# EAGLE design as3320-BandPass-Dev1 (EAGLE 9.6.2)

## Sheet 1 of 5: CEM
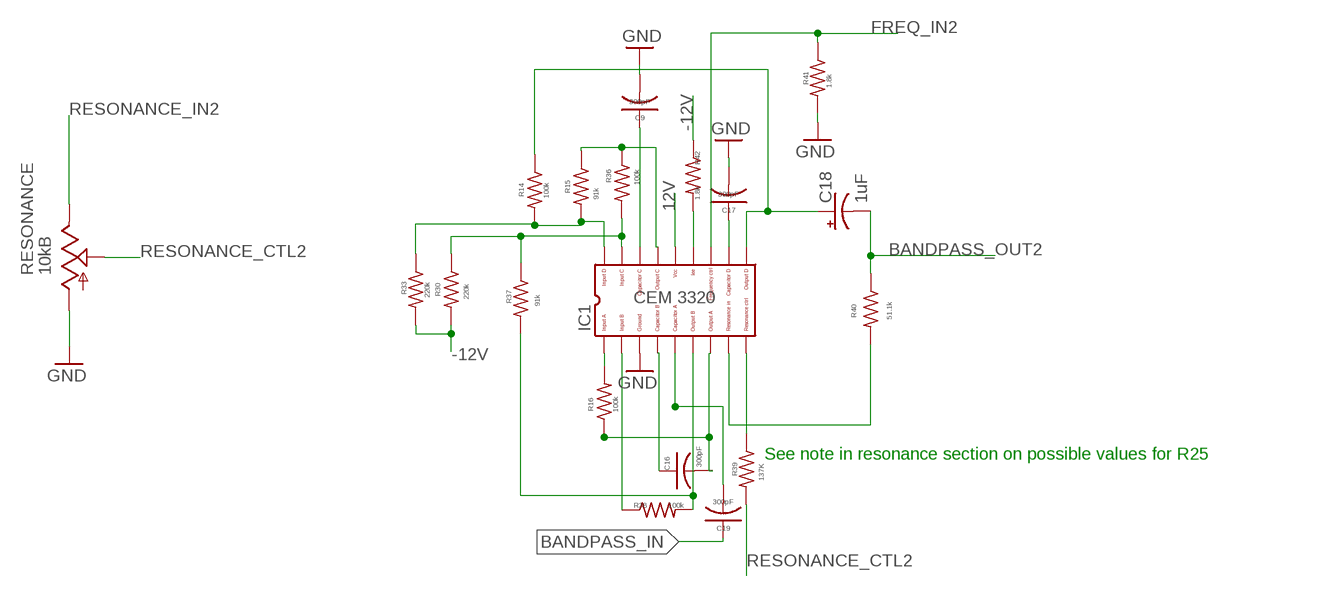
[diagram p0: schematic, sheet 1]

### Parts
C9  300pF  C-USC0805K  [C0805K]
C16  300pF  C-USC0805K  [C0805K]
C17  300pF  C-USC0805K  [C0805K]
C18  1uF  CPOL-USB  [PANASONIC_B]
C19  300pF  C-USC0805K  [C0805K]
IC1  CEM3320  [DIL18]
R14  100k  GMSN_R-US_M0805  [GMSN_M0805]
R15  91k  GMSN_R-US_M0805  [GMSN_M0805]
R16  100k  GMSN_R-US_M0805  [GMSN_M0805]
R30  220k  GMSN_R-US_M0805  [GMSN_M0805]
R33  220k  GMSN_R-US_M0805  [GMSN_M0805]
R36  100k  GMSN_R-US_M0805  [GMSN_M0805]
R37  91k  GMSN_R-US_M0805  [GMSN_M0805]
R38  100k  GMSN_R-US_M0805  [GMSN_M0805]
R39  137K  GMSN_R-US_M0805  [GMSN_M0805]
R40  51.1k  GMSN_R-US_M0805  [GMSN_M0805]
R41  1.8k  GMSN_R-US_M0805  [GMSN_M0805]
R42  1.8k  GMSN_R-US_M0805  [GMSN_M0805]
RESONANCE  10kB  POT_USVERTICAL  [ALPS_POT_VERTICAL]

### Nets
12V [power]: IC1.14 ; also sheet 2,3
-12V [power]: R30.2 R33.2 R42.1 ; also sheet 2,3
BANDPASS_IN: C19.1 ; also sheet 3
BANDPASS_OUT2: C18.- R40.1 ; also sheet 5
FREQ_IN2: IC1.12 R41.1 ; also sheet 3
GND [power]: C9.2 C17.2 IC1.3 R41.2 RESONANCE.P$3(A) ; also sheet 2,3,4,5
N$18 [nearfilter]: C17.1 IC1.11
N$21: IC1.9 R39.1
N$28 [nearfilter]: IC1.8 R40.2
N$29 [nearfilter]: IC1.13 R42.2
N$30: C9.1 IC1.16
N$31 [nearfilter]: C18.+ IC1.10 R14.1
N$32: C19.2 IC1.5
N$33: C16.2 IC1.7 R16.1
N$34: C16.1 IC1.4
N$35: IC1.2 R38.1
N$36: IC1.6 R37.2 R38.2
N$37: IC1.1 R16.2
N$38: IC1.17 R30.1 R36.2 R37.1
N$41: IC1.15 R15.1 R36.1
N$42: IC1.18 R14.2 R15.2 R33.1
RESONANCE_CTL2: R39.2 RESONANCE.P$2(S)
RESONANCE_IN2: RESONANCE.P$1(E) ; also sheet 3

### Notes on the sheet
- See note in resonance section on possible values for R25

## Sheet 2 of 5: Power
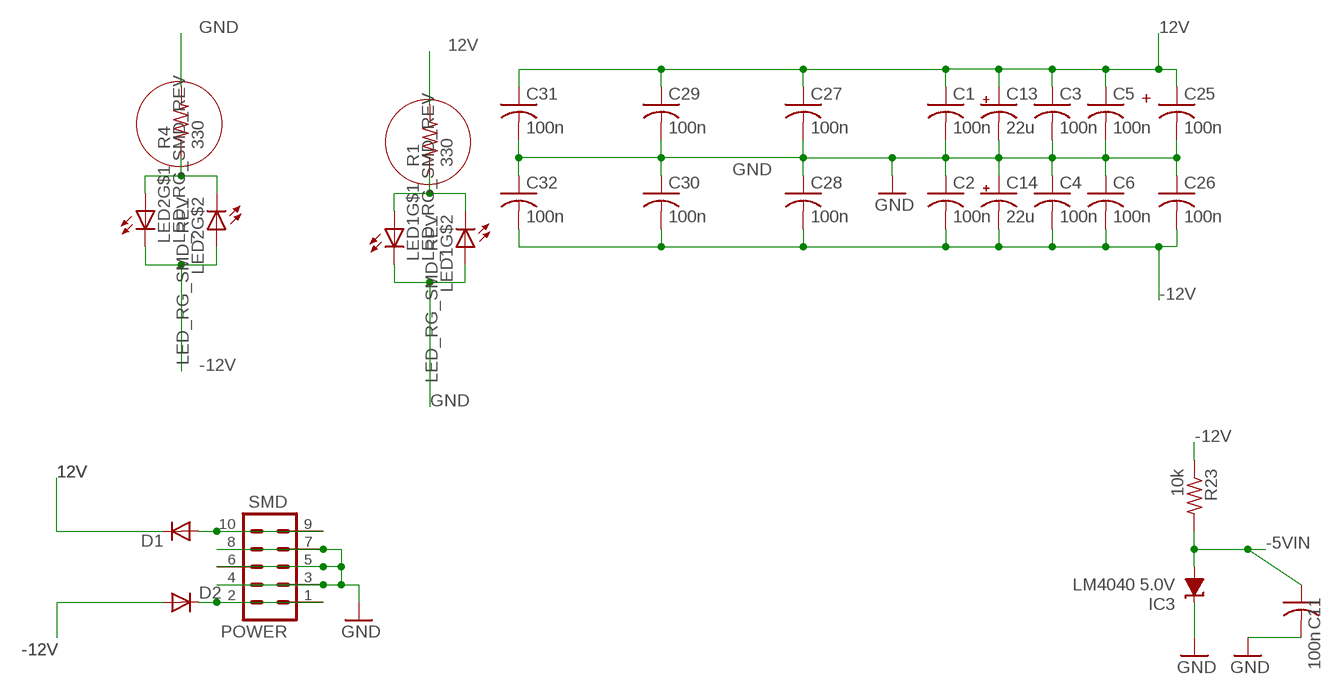
[diagram p1: schematic, sheet 2]

### Parts
C1  100n  C-USC0805K  [C0805K]
C2  100n  C-USC0805K  [C0805K]
C3  100n  C-USC0805K  [C0805K]
C4  100n  C-USC0805K  [C0805K]
C5  100n  C-USC0805K  [C0805K]
C6  100n  C-USC0805K  [C0805K]
C11  100n  GMSN_C-USC0805K  [GMSN_C0805K]
C13  22u  CPOL-USB  [PANASONIC_B]
C14  22u  CPOL-USB  [PANASONIC_B]
C25  100n  C-USC0805K  [C0805K]
C26  100n  C-USC0805K  [C0805K]
C27  100n  C-USC0805K  [C0805K]
C28  100n  C-USC0805K  [C0805K]
C29  100n  C-USC0805K  [C0805K]
C30  100n  C-USC0805K  [C0805K]
C31  100n  C-USC0805K  [C0805K]
C32  100n  C-USC0805K  [C0805K]
D1  1N5819HW  DIODE-SOD123  [SOD123]
D2  1N5819HW  DIODE-SOD123  [SOD123]
IC3  LM4040 5.0V  LM4041C12DBZ  [DBZ_R-PDSO-G3]
LED1  LED_RG_SMD_REV  [LSG_T77K]
LED2  LED_RG_SMD_REV  [LSG_T77K]
POWER  SMD  CONN_05X2SHD_SMD  [2X5-SHROUDED_SMD]
R1  330  GMSN_R-US_M0805  [GMSN_M0805]
R4  330  GMSN_R-US_M0805  [GMSN_M0805]
R23  10k  GMSN_R-US_M0805  [GMSN_M0805]

### Nets
12V [power]: C1.1 C3.1 C5.1 C13.+ C25.1 C27.1 C29.1 C31.1 D1.C R1.2 ; also sheet 1,3
-5VIN [power]: C11.1 IC3.2(A) R23.2 ; also sheet 4
-12V [power]: C2.2 C4.2 C6.2 C14.- C26.2 C28.2 C30.2 C32.2 D2.A LED2.1(C) LED2.4(A) R23.1 ; also sheet 1,3
-12V-P: D2.C POWER.1 POWER.2
GND [power]: C1.2 C2.1 C3.2 C4.1 C5.2 C6.1 C11.2 C13.- C14.+ C25.2 C26.1 C27.2 C28.1 C29.2 C30.1 C31.2 C32.1 IC3.1(C) LED1.1(C) LED1.4(A) POWER.3 POWER.4 POWER.5 POWER.6 POWER.7 POWER.8 R4.2 ; also sheet 1,3,4,5
N$6: D1.A POWER.9 POWER.10
N$74: LED2.2(A) LED2.3(C) R4.1
N$75: LED1.2(A) LED1.3(C) R1.1

### Notes on the sheet
- +

## Sheet 3 of 5: Input
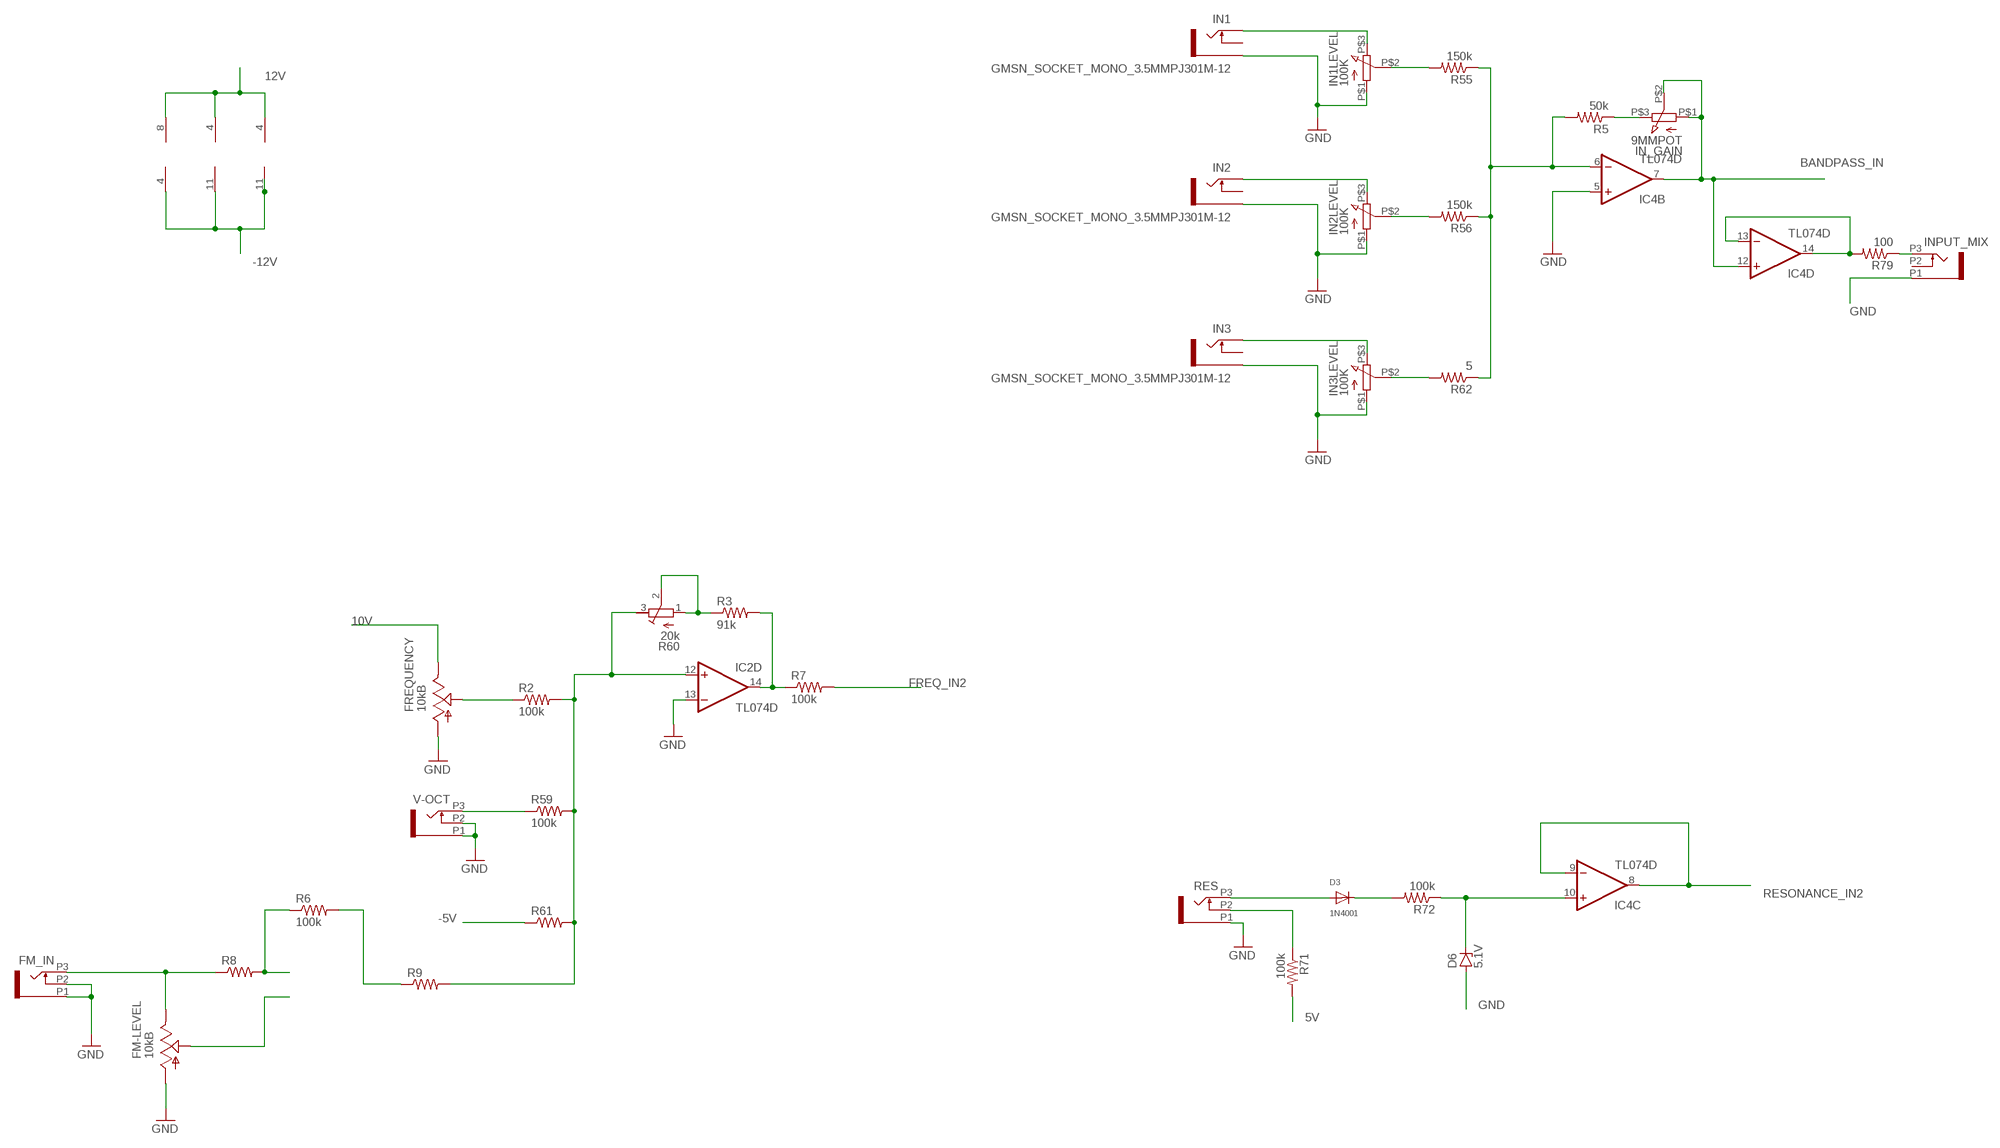
[diagram p2: schematic, sheet 3]

### Parts
D3  1N4001  DIODESMA  [SMADIODE]
D6  5.1V  ZENER-DIODESOT23  [SOT23]
FM-LEVEL  10kB  POT_USVERTICAL  [ALPS_POT_VERTICAL]
FM_IN  PJ301_THONKICONN6  [WQP_PJ_301M6]
FREQUENCY  10kB  POT_USVERTICAL  [ALPS_POT_VERTICAL]
IC2  TL074D  [SO14]
IC4  TL074D  [SO14]
IC5  TL072D  [SO08]
IN1  GMSN_SOCKET_MONO_3.5MMPJ301M-12  [GMSN_PJ301M-12]
IN1LEVEL  100K  9MMPOT  [POT]
IN2  GMSN_SOCKET_MONO_3.5MMPJ301M-12  [GMSN_PJ301M-12]
IN2LEVEL  100K  9MMPOT  [POT]
IN3  GMSN_SOCKET_MONO_3.5MMPJ301M-12  [GMSN_PJ301M-12]
IN3LEVEL  100K  9MMPOT  [POT]
IN_GAIN  9MMPOT  [POT]
INPUT_MIX  PJ301_THONKICONN6  [WQP_PJ_301M6]
R2  100k  GMSN_R-US_M0805  [GMSN_M0805]
R3  91k  GMSN_R-US_M0805  [GMSN_M0805]
R5  50k  GMSN_R-US_M0805  [GMSN_M0805]
R6  100k  GMSN_R-US_M0805  [GMSN_M0805]
R7  100k  GMSN_R-US_M0805  [GMSN_M0805]
R8  62k  GMSN_R-US_M0805  [GMSN_M0805]
R9  62k  GMSN_R-US_M0805  [GMSN_M0805]
R55  150k  R-US_R0805  [R0805]
R56  150k  R-US_R0805  [R0805]
R59  100k  GMSN_R-US_M0805  [GMSN_M0805]
R60  20k  R-TRIMM3296X  [RTRIM3296X]
R61  62k  GMSN_R-US_M0805  [GMSN_M0805]
R62  5  R-US_R0805  [R0805]
R71  100k  R-US_R0805  [R0805]
R72  100k  GMSN_R-US_M0805  [GMSN_M0805]
R79  100  GMSN_R-US_M0805  [GMSN_M0805]
RES  PJ301_THONKICONN6  [WQP_PJ_301M6]
V-OCT  PJ301_THONKICONN6  [WQP_PJ_301M6]

### Nets
5V [power]: R71.2 ; also sheet 4
10V [power]: FREQUENCY.P$1(E) ; also sheet 4
12V [power]: IC2.4(P:V+) IC4.4(P:V+) IC5.8(P:V+) ; also sheet 1,2
-5V [power]: R61.1 ; also sheet 4
-12V [power]: IC2.11(P:V-) IC4.11(P:V-) IC5.4(P:V-) ; also sheet 1,2
BANDPASS_IN: IC4.7(B:OUT) IC4.12(D:+IN) IN_GAIN.P$1 IN_GAIN.P$2 ; also sheet 1
FREQ_IN2: R7.2 ; also sheet 1
GND [power]: D6.1(A) FM-LEVEL.P$3(A) FM_IN.P1 FM_IN.P2 FREQUENCY.P$3(A) IC2.13(D:-IN) IC4.5(B:+IN) IN1.GND(SLEEVE) IN1LEVEL.P$1 IN2.GND(SLEEVE) IN2LEVEL.P$1 IN3.GND(SLEEVE) IN3LEVEL.P$1 INPUT_MIX.P1 RES.P1 V-OCT.P1 V-OCT.P2 ; also sheet 1,2,4,5
N$1: R6.2 R9.1
N$2: R6.1 R8.2
N$3: IC2.14(D:OUT) R3.2 R7.1
N$5: FREQUENCY.P$2(S) R2.1
N$7: FM-LEVEL.P$2(S)
N$8: FM-LEVEL.P$1(E) FM_IN.P3 R8.1
N$9: R71.1 RES.P2
N$12: IC2.12(D:+IN) R2.2 R9.2 R59.2 R60.3(A) R61.2
N$20: IN_GAIN.P$3 R5.1
N$67: R59.1 V-OCT.P3
N$68: R3.1 R60.1(E) R60.2(S)
N$76: IN1.TIP IN1LEVEL.P$3
N$77: IN2.TIP IN2LEVEL.P$3
N$78: D3.A RES.P3
N$79: IN1LEVEL.P$2 R55.2
N$80: IN2LEVEL.P$2 R56.2
N$82: IN3.TIP IN3LEVEL.P$3
N$83: IN3LEVEL.P$2 R62.2
N$84: IC4.6(B:-IN) R5.2 R55.1 R56.1 R62.1
N$85: D3.C R72.2
N$89: D6.3(C) IC4.10(C:+IN) R72.1
N$102: IC4.13(D:-IN) IC4.14(D:OUT) R79.2
N$103: INPUT_MIX.P3 R79.1
RESONANCE_IN2: IC4.8(C:OUT) IC4.9(C:-IN) ; also sheet 1
Unconnected: IC5.1(A:OUT) IC5.2(A:-IN) IC5.3(A:+IN) IN1.NORM(SWITCH) IN2.NORM(SWITCH) IN3.NORM(SWITCH) INPUT_MIX.P2

## Sheet 4 of 5: Ref
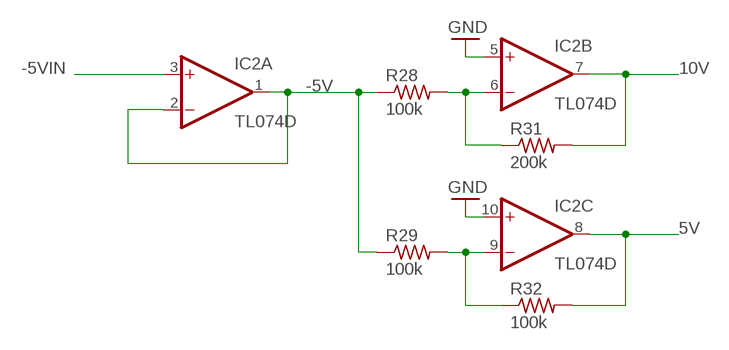
[diagram p3: schematic, sheet 4]

### Parts
R28  100k  GMSN_R-US_M0805  [GMSN_M0805]
R29  100k  GMSN_R-US_M0805  [GMSN_M0805]
R31  200k  GMSN_R-US_M0805  [GMSN_M0805]
R32  100k  GMSN_R-US_M0805  [GMSN_M0805]

### Nets
5V [power]: IC2.8(C:OUT) R32.2 ; also sheet 3
10V [power]: IC2.7(B:OUT) R31.2 ; also sheet 3
-5V [power]: IC2.1(A:OUT) IC2.2(A:-IN) R28.1 R29.1 ; also sheet 3
-5VIN [power]: IC2.3(A:+IN) ; also sheet 2
GND [power]: IC2.5(B:+IN) IC2.10(C:+IN) ; also sheet 1,2,3,5
N$13: IC2.9(C:-IN) R29.2 R32.1
N$15: IC2.6(B:-IN) R28.2 R31.1

## Sheet 5 of 5: Output
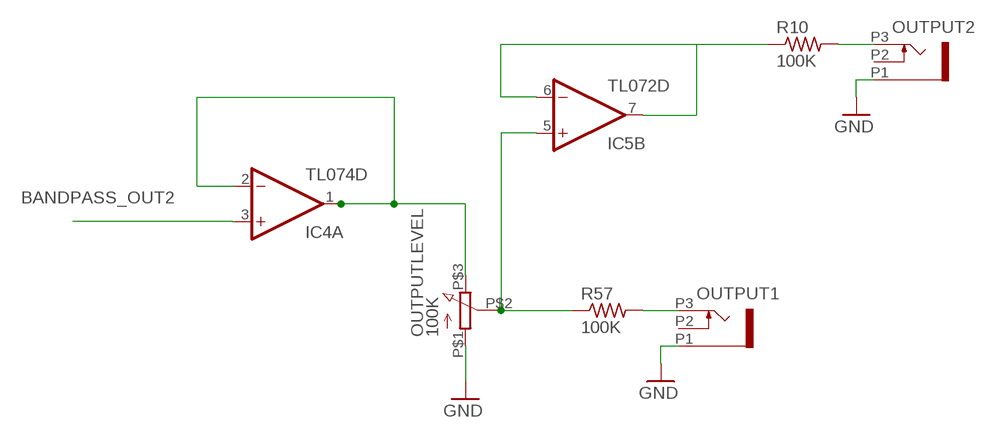
[diagram p4: schematic, sheet 5]

### Parts
OUTPUT1  PJ301_THONKICONN6  [WQP_PJ_301M6]
OUTPUT2  PJ301_THONKICONN6  [WQP_PJ_301M6]
OUTPUTLEVEL  100K  9MMPOT  [POT]
R10  100K  GMSN_R-US_M0805  [GMSN_M0805]
R57  100K  GMSN_R-US_M0805  [GMSN_M0805]

### Nets
BANDPASS_OUT2: IC4.3(A:+IN) ; also sheet 1
GND [power]: OUTPUT1.P1 OUTPUT2.P1 OUTPUTLEVEL.P$1 ; also sheet 1,2,3,4
N$10: IC5.6(B:-IN) IC5.7(B:OUT)
N$11: IC5.5(B:+IN) OUTPUTLEVEL.P$2 R57.1
N$14: R10.1
N$63: IC4.1(A:OUT) IC4.2(A:-IN) OUTPUTLEVEL.P$3
O1: OUTPUT2.P3 R10.2
O2: OUTPUT1.P3 R57.2
Unconnected: OUTPUT1.P2 OUTPUT2.P2

## Library data of the parts
C1-C6 C9 C16 C17 C19 C25-C32 = rcl:C-US: CAPACITOR, American symbol; SPICEPREFIX: C
C11 = Pure VCF:GMSN_C-US: CAPACITOR, American symbol
C13 C14 = rcl:CPOL-US: POLARIZED CAPACITOR, American symbol
C18 = rcl:CPOL-US: POLARIZED CAPACITOR, American symbol; SPICEPREFIX: C
D1 D2 = diode:DIODE-: DIODE
D3 = GMSN:DIODE: Diode SMADIODE - SMA Surface Mount Package 20V 1A Schottky Diode Digikey: 641-1014-6-ND DO-1N4148 - Through Hole Small Current Diode SOD-123 20V 1 A (.5mV Vf) Schottky Diode - Digikey: MBRX120TPMSCT-ND SOD-323 10V 570mA (.38mV Vf, 3ns) Schottky Diode - Digikey: ZLLS410CT-ND SOD-523 30V 30mA Schottky Diode (RB751S-40TE61) - Digikey: RB751S-40TE61CT-ND SOT23-R/W - SOT23 Package (R = Solder Paste/Reflow Ovens, W = Hand-Soldering) BAT54Film 40V 300mA - Digikey: 497-7162-1-ND
D6 = diode:ZENER-DIODE: Z-Diode; RS-PART: 816-7962
FM-LEVEL FREQUENCY RESONANCE = og-pots:POT_US
FM_IN INPUT_MIX OUTPUT1 OUTPUT2 RES V-OCT = og-pj301_variations:PJ301_THONKICONN
IC1 = CEM:CEM3320: CEM 3330 VCF
IC2 = linear:TL074: OP AMP
IC3 = texas:LM4041: PRECISION MICROPOWER SHUNT VOLTAGE REFERENCE Source: http://focus.ti.com/lit/ds/slcs146e/slcs146e.pdf
IC4 = GMSN:TL074: OP AMP
IC5 = GMSN-R2Project:TL072: OP AMP
IN1-IN3 = Pure VCO:GMSN_SOCKET_MONO_3.5MM: 3.5 mm Jack Socket; SORT: 8
IN1LEVEL IN2LEVEL IN3LEVEL IN_GAIN OUTPUTLEVEL = GMSN:9MMPOT
LED1 = INSTRUO:LED_RG_SMD_REV: http://uk.rs-online.com/web/p/visible-leds/7193196/; RS-PART: 915-4828
LED2 = INSTRUO:LED_RG_SMD_REV: http://uk.rs-online.com/web/p/visible-leds/7193196/
POWER = SparkFun-Connectors:CONN_05X2: Multi connection point. Often used as Generic Header-pin footprint for 0.1 inch spaced/style header connections For AVR SPI programming port, see special device with nice symbol: "AVR_SPI_PROG_5x2.dev" You can populate with any combo of single row headers, but if you'd like an exact match, check these: 2x5 AVR ICSP Male Header <https://www.sparkfun.com/products/778> (PRT-00778) 2x5 Pin Shrouded Header <https://www.sparkfun.com/products/8506> (PRT-08506) On any of the 0.1 inch spaced packages, you can populate with these: Break Away Headers - Straight <https://www.sparkfun.com/products/116> (PRT-00116) Break Away Male Headers - Right Angle <https://www.sparkfun.com/products/553> (PRT-00553) Female Headers <https://www.sparkfun.com/products/115> (PRT-00115) Break Away Headers - Machine Pin <https://www.sparkfun.com/products/117> (PRT-00117) Break Away Female Headers - Swiss Machine Pin <https://www.sparkfun.com/products/743> (PRT-00743) Special note: the shrouded connector mates well with our 5x2 ribbon cables: 2x5 Pin IDC Ribbon Cable <https://www.sparkfun.com/products/8535> (PRT-08535); PROD_ID: CONN-09508; RS-PART: 828-1783
R1-R3 R5-R10 R14-R16 R23 R28-R33 R36-R42 R57 R59 R61 R72 R79 = Pure VCF:GMSN_R-US_: RESISTOR, American symbol
R4 = Pure VCF:GMSN_R-US_: RESISTOR, American symbol; RS-PART: 915-4828
R55 R56 R62 R71 = GMSN:R-US_: RESISTOR, American symbol
R60 = rcl:R-TRIMM: Trimm resistor

## Net classes
0 default: width 0.152 mm
1 power: width 0.406 mm
2 nearfilter: width 0.152 mm

## Board
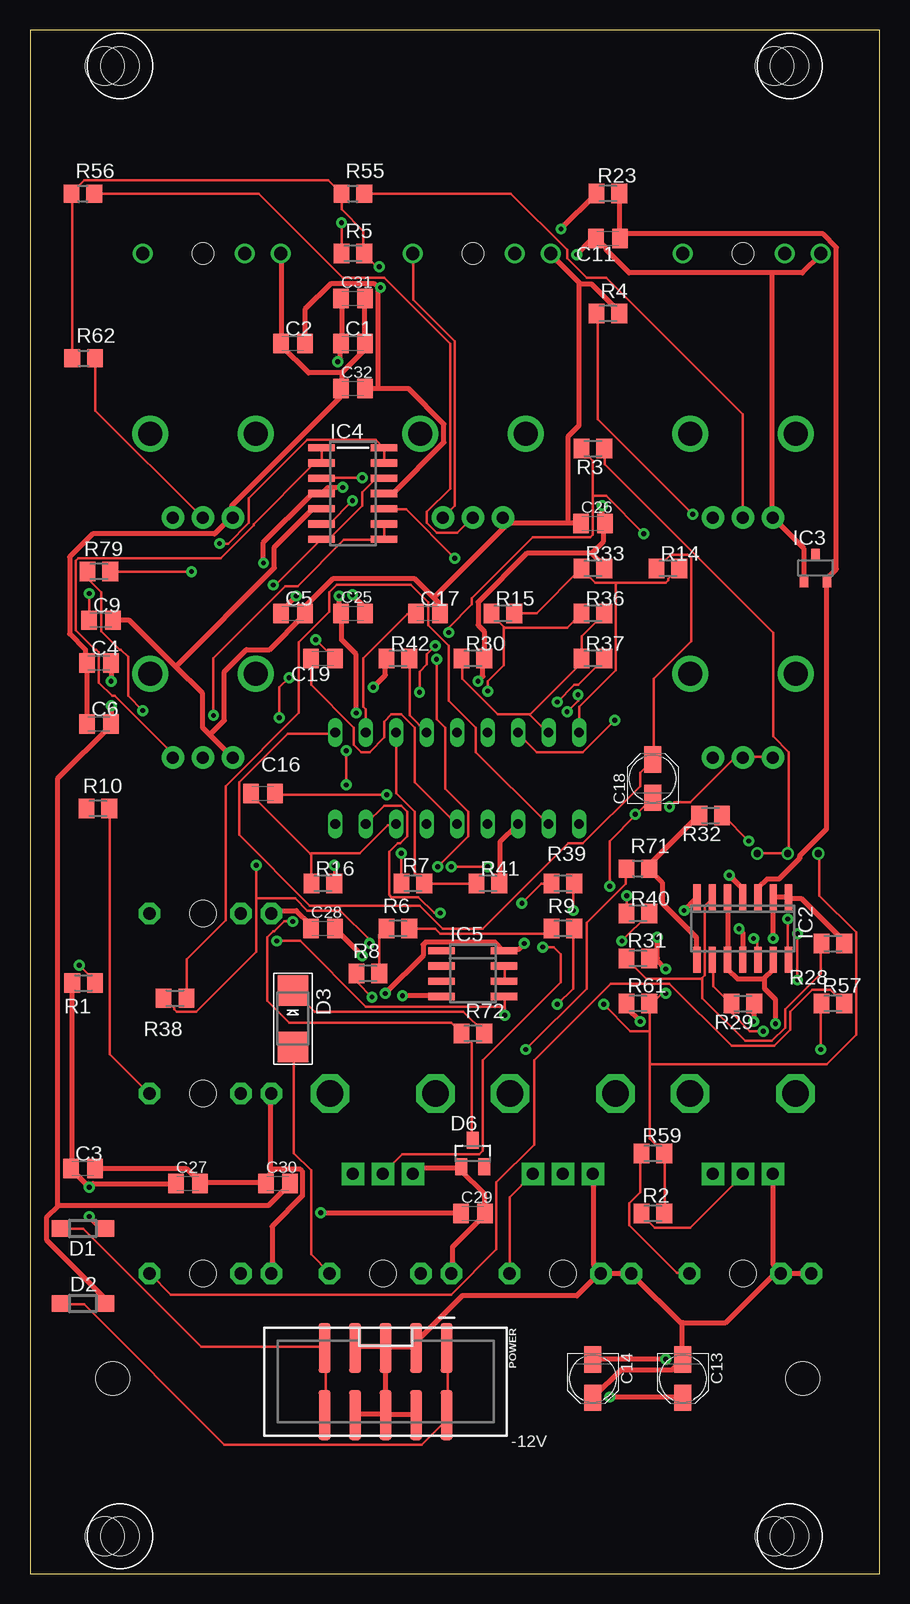
[diagram p5: board, top side]
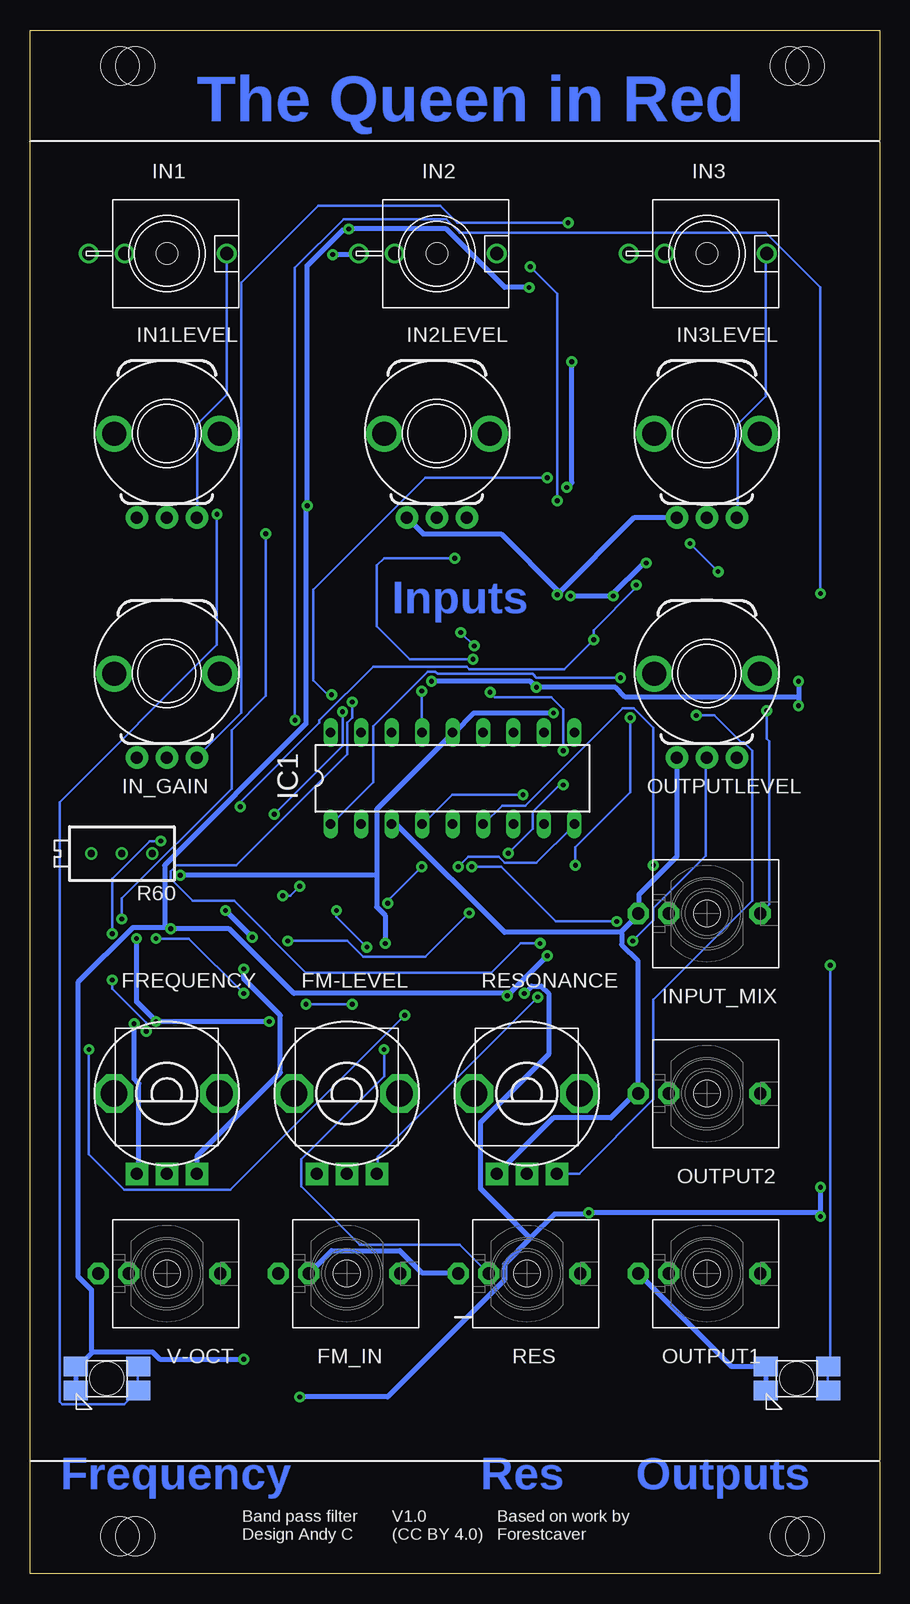
[diagram p6: board, bottom side, seen from below]

Size 70.8 x 128.63 mm. Coordinates in mm from the lower left corner, seen from the top.
Outline: 70.8,0 70.8,128.63 0,128.63 0,0 70.8,0
Copper layers (1*16): Top 0.035mm / dielectric 1.5mm / Bottom 0.035mm
Design rules "Mutable_PCBCart-Standard *": minimum track width 8mil, minimum drill 0.4mm, track to track 8mil, track to pad 8mil, pad to pad 8mil, via to via 8mil, smd to smd 8mil, copper to edge 20mil, drill to drill 8mil, minimum pad ring 8mil, minimum via ring 10mil, stop-mask expansion 3mil, vias tented up to drill 25mil, thermal gap 8mil

### Footprints (pad centres in the part's own frame; a part is rotated, then mirrored left to right if it is on the bottom)
C0805K = smd 1.3 x 1.6: 1 -1,0; 2 1,0
GMSN_C0805K = smd 1.3 x 1.6: 1 -1,0; 2 1,0
PANASONIC_B = smd 2.2 x 1.4: + 1.6,0; - -1.6,0
SOD123 = smd 1.4 x 1.4: A 1.9,0; C -1.9,0
SMADIODE = smd 2.54 x 2.54: A 2.349,0; C -2.349,0
SOT23 = smd 1 x 1.4: 1 -0.95,-1.1; 2 0.95,-1.1; 3 0,1.1
ALPS_POT_VERTICAL = drill 1 pad 1.88 square: P$1 -2.5,6.7; P$2 0,6.7; P$3 2.5,6.7 | drill 2.2 pad 3.175 octagon: P$4 -4.4,0; P$5 4.4,0
WQP_PJ_301M6 = drill 1.016 pad 1.778 octagon: P1 0,-5.715; P2 0,-3.175; P3 0,4.445 | hole 2.2: 0,0
DIL18 = drill 0.813 long: 1 -10.16,-3.81; 2 -7.62,-3.81; 3 -5.08,-3.81; 4 -2.54,-3.81; 5 0,-3.81; 6 2.54,-3.81; 7 5.08,-3.81; 8 7.62,-3.81; 9 10.16,-3.81; 10 10.16,3.81; 11 7.62,3.81; 12 5.08,3.81; 13 2.54,3.81; 14 0,3.81; 15 -2.54,3.81; 16 -5.08,3.81; 17 -7.62,3.81; 18 -10.16,3.81
SO14 = smd 0.6 x 2.2: 1 -3.81,-2.6; 2 -2.54,-2.6; 3 -1.27,-2.6; 4 0,-2.6; 5 1.27,-2.6; 6 2.54,-2.6; 7 3.81,-2.6; 8 3.81,2.6; 9 2.54,2.6; 10 1.27,2.6; 11 0,2.6; 12 -1.27,2.6; 13 -2.54,2.6; 14 -3.81,2.6
DBZ_R-PDSO-G3 = smd 0.7 x 1: 1 -0.95,-1.1; 2 0.95,-1.1; 3 0,1.1
SO08 = smd 0.6 x 2.2: 1 -1.905,-2.6; 2 -0.635,-2.6; 3 0.635,-2.6; 4 1.905,-2.6; 5 1.905,2.6; 6 0.635,2.6; 7 -0.635,2.6; 8 -1.905,2.6
GMSN_PJ301M-12 = drill 1.1: GND 0,-6.5; NORM 0,-3.5; TIP 0,5 | hole 1.778: 0,0
POT = drill 1 pad 1.88: P$1 -2.5,-7; P$2 0,-7; P$3 2.5,-7 | drill 2 pad 2.68: P$4 -4.4,0; P$5 4.4,0
LSG_T77K = smd 2 x 1.6: 1 -2.6,-1; 2 2.6,-1; 3 2.6,1; 4 -2.6,1 | hole 2.8: 0,0
2X5-SHROUDED_SMD = smd 4.15 x 1: 1 -2.794,5.08; 2 2.794,5.08; 3 -2.794,2.54; 4 2.794,2.54; 5 -2.794,0; 6 2.794,0; 7 -2.794,-2.54; 8 2.794,-2.54; 9 -2.794,-5.08; 10 2.794,-5.08
GMSN_M0805 = smd 1.3 x 1.6: 1 -0.95,0; 2 0.95,0
R0805 = smd 1.3 x 1.5: 1 -0.95,0; 2 0.95,0
RTRIM3296X = drill 0.61: 1 0,-2.54; 2 0,0; 3 0,2.54
MOUNTING_HOLE = hole 3.2: 0,0; 0,1.27

### Placement (x,y rotation side)
C1  26.9,102.5 0 top
C2  21.9,102.5 0 top
C3  4.4,33.75 0 top
C4  5.74,75.88 0 top
C5  21.9,80 0 top
C6  5.74,70.8 0 top
C9  5.9,79.45 0 top
C11  48.15,111.25 180 top
C13  54.4,16.25 270 top
C14  46.9,16.25 270 top
C16  19.4,65 180 top
C17  33.15,80 0 top
C18  51.9,66.25 90 top
C19  24.4,76.25 180 top
C25  26.9,80 0 top
C26  46.9,87.5 0 top
C27  13.15,32.5 0 top
C28  24.4,53.75 0 top
C29  36.9,30 0 top
C30  20.65,32.5 0 top
C31  26.9,106.25 0 top
C32  26.9,98.75 0 top
D1  4.4,28.75 180 top
D2  4.4,22.5 0 top
D3  21.9,46.25 270 top
D6  36.9,35 0 top
FM-LEVEL  44.4,40 180 bottom
FM_IN  44.4,25 270 bottom
FREQUENCY  59.4,40 180 bottom
IC1  35.59,66.27 0 bottom
IC2  59.4,53.75 180 top
IC3  65.45,83.8 0 top
IC4  26.9,90 270 top
IC5  36.9,50 270 top
IN1  59.4,110 270 bottom
IN1LEVEL  59.4,95 0 bottom
IN2  36.9,110 270 bottom
IN2LEVEL  36.9,95 0 bottom
IN3  14.4,110 270 bottom
IN3LEVEL  14.4,95 0 bottom
IN_GAIN  59.4,75 0 bottom
INPUT_MIX  14.4,55 270 bottom
LED1  6.9,16.25 0 bottom
LED2  64.4,16.25 0 bottom
OUTPUT1  14.4,25 270 bottom
OUTPUT2  14.4,40 270 bottom
OUTPUTLEVEL  14.4,75 0 bottom
POWER  29.64,16 270 top
R1  4.47,49.21 180 top
R2  51.9,30 0 top
R3  46.9,93.75 180 top
R4  48.15,105 0 top
R5  26.9,110 0 top
R6  30.65,53.75 0 top
R7  31.9,57.5 0 top
R8  28.15,50 0 top
R9  44.4,53.75 0 top
R10  5.65,63.75 0 top
R14  53.15,83.75 0 top
R15  39.4,80 0 top
R16  24.4,57.5 0 top
R23  48.15,115 0 top
R28  66.9,52.5 180 top
R29  59.4,47.5 180 top
R30  36.9,76.25 0 top
R31  50.65,51.25 0 top
R32  56.72,63.18 180 top
R33  46.9,83.75 0 top
R36  46.9,80 0 top
R37  46.9,76.25 0 top
R38  12.09,47.94 180 top
R39  44.4,57.5 0 top
R40  50.65,55 0 top
R41  38.15,57.5 0 top
R42  30.65,76.25 0 top
R55  26.9,115 0 top
R56  4.4,115 0 top
R57  66.9,47.5 0 top
R59  51.9,35 0 top
R60  63.15,60 90 bottom
R61  50.65,47.5 0 top
R62  4.47,101.28 0 top
R71  50.65,58.75 0 top
R72  36.9,45 0 top
R79  5.74,83.5 0 top
RES  29.4,25 270 bottom
RESONANCE  29.4,40 180 bottom
U$2  [MOUNTING_HOLE]  7.5,3.11 90 top
U$3  [MOUNTING_HOLE]  63.3,3.11 90 top
U$4  [MOUNTING_HOLE]  63.3,125.63 90 top
U$5  [MOUNTING_HOLE]  7.5,125.63 90 top
V-OCT  59.4,25 270 bottom

### Tracks (layer width: path | path; a pad name or v marks a point on that pad's centre or on a via)
5V
  Top 0.406: R32.2 55.73,63.18 51.66,59.12 51.66,58.81 R71.2 51.66,58.61 52.68,57.59 52.68,55.87 55.52,53.02 55.52,51.19 IC2.8
10V  (via drill 0.4)
  Top 0.406: 52.17,51.19 51.66,51.19 R31.2 | v52.98,50.38 52.17,51.19 | v54.51,55.26 55.52,56.27 IC2.7 | v52.27,53.02 52.27,51.29 52.17,51.19
  Bottom 0.406: v52.98,50.38 52.98,49.57 49.94,46.52 49.94,41.74 56.85,34.83 56.85,33.31 FREQUENCY.P$1 | v52.27,53.02 v54.51,55.26
12V  (via drill 0.4)
  Top 0.406: v4.93,29.75 5.84,28.84 6.25,28.84 D1.C | R1.2 3.51,49.16 3.51,33.92 C3.1 3.4,33.72 v4.93,32.19 5.23,32.5 C27.1 | v24.23,30.06 35.81,30.06 C29.1 | v48.31,14.72 54.31,14.72 C13.+ | C31.1 25.96,106.16 25.96,102.6 C1.1 25.86,102.3 25.86,101.18 v25.65,100.97 | v22.2,81.47 20.98,80.25 20.98,80.05 C5.1 | v25.76,81.47 25.76,80.15 25.86,80.05 C25.1 25.96,79.84 25.96,77.81 27.18,76.59 v27.18,71.71 | v19.46,84.21 19.46,85.94 23.42,89.9 24.23,89.9 IC4.4 24.43,90.1 24.84,90.51 v26.06,90.51 | v41.2,52.51 40.69,52 39.57,52 IC5.8 39.37,52 38.76,52.61 32.97,52.61 32.77,52.41 32.77,51.5 v29.62,48.35 | v58.27,58.2 59.39,57.08 59.39,56.37 IC2.4
  Bottom 0.406: v4.93,32.19 v4.93,29.75 5.03,30.06 v24.23,30.06 24.33,29.96 27.08,29.96 29.11,27.93 | v48.31,14.72 41,14.72 31.24,24.47 31.24,25.79 29.11,27.93 | v25.76,81.47 v22.2,81.47 22.3,81.57 19.66,84.21 v19.46,84.21 | v25.65,100.97 25.65,90.92 v26.06,90.51 | v41.2,52.51 41.2,54.85 41.91,55.56 41.91,58.2 | 41.91,58.2 41.91,63.69 35.61,69.99 IC1.14 35.41,70.09 33.78,71.71 v27.18,71.71 | 41.91,58.2 v58.27,58.2 | 29.11,27.93 33.27,32.09 33.27,37.58 27.58,43.27 27.58,48.35 28.19,48.96 29.01,48.96 v29.62,48.35
-5V  (via drill 0.4)
  Top 0.406: R28.1 67.82,52.51 67.82,52.72 64.26,56.27 63.25,56.27 IC2.1 63.04,56.37 62.03,56.37 IC2.2 61.93,56.17 v61.93,52.92 | v50.85,46.01 49.73,47.13 49.73,47.43 R61.1 | v60.3,46.01 60.3,47.43 R29.1
  Bottom 0.406: v50.85,46.01 v60.3,46.01 61.93,47.64 v61.93,52.92
-5VIN
  Top 0.406: R23.2 49.12,115 49.12,111.34 C11.1 49.23,111.64 66.09,111.64 67.21,110.53 67.21,83.7 66.4,82.89 IC3.2 66.4,82.69 66.4,62.06 64.16,59.83 64.16,59.62 62.43,57.9 61.42,57.9 60.71,57.19 60.71,56.37 IC2.3
-12V  (via drill 0.4)
  Top 0.406: v52.98,17.87 46.99,17.87 C14.- | v27.69,51.5 25.45,53.73 C28.2 | v31.04,48.14 34.29,48.14 IC5.4 | v59.08,53.73 59.39,53.43 59.39,51.19 IC2.11 | 29.01,98.74 31.55,98.74 34.49,95.79 34.49,94.27 30.23,90 29.51,90 IC4.11 | 29.01,98.74 27.99,98.74 C32.2 | 29.01,107.17 28.7,107.48 25.04,107.48 22.91,105.34 22.91,102.6 C2.2 | 29.01,98.74 29.01,107.17 | v44.25,112.05 R23.1 | v29.21,107.17 29.01,107.17 | 2.39,30.67 1.37,29.65 1.37,27.82 6.25,22.95 6.25,22.54 D2.A | 2.39,30.67 19.86,30.67 21.69,32.5 C30.2 | 46.79,85.02 41.4,85.02 37.34,80.96 37.34,79.03 37.85,78.52 37.85,76.29 R30.2 37.74,76.08 37.74,74.76 v37.34,74.36 | 46.79,85.02 47.8,84.01 47.8,83.81 R33.2 | 46.79,85.02 47.8,86.04 47.8,87.46 C26.2 47.7,87.56 v47.7,88.99 | v6.76,72.32 6.76,70.8 C6.2 6.76,70.7 2.29,66.23 2.29,30.77 2.39,30.67 | v6.76,74.36 6.76,75.88 C4.2 | v28.6,73.85 29.62,74.86 29.62,76.19 R42.1
  Bottom 0.406: LED2.1 67.01,15.33 67.01,17.16 LED2.4 66.8,17.26 65.58,18.48 | v52.98,17.87 59.99,17.87 60.6,18.48 65.58,18.48 | v27.69,51.5 v31.04,48.14 31.04,48.35 48.82,48.35 54.2,53.73 v59.08,53.73 59.18,53.83 59.59,53.83 | 59.59,53.83 62.23,53.83 66.8,49.26 66.8,24.77 65.68,23.66 65.68,18.58 65.58,18.48 | v29.21,107.17 31.24,107.17 36.12,112.05 v44.25,112.05 44.35,111.95 44.75,111.95 47.7,109 v47.7,88.99 47.8,88.89 47.8,70.8 59.59,59.01 59.59,53.83 | v6.76,74.36 6.76,73.03 | 6.76,73.03 v6.76,72.32 | 6.76,73.03 21.18,73.03 22,73.85 v28.6,73.85 29.11,74.36 v37.34,74.36
-12V-P
  Top 0.203: D2.C 2.59,22.44 4.52,22.44 16.21,10.75 32.66,10.75 34.7,12.79 34.7,13.19 POWER.2 34.8,13.29 34.8,18.78 POWER.1
BANDPASS_IN  (via drill 0.4)
  Top 0.203: IN_GAIN.P$1 61.82,68.06 59.49,68.06 IN_GAIN.P$2 59.39,67.95 58.67,67.95 55.02,64.3 53.7,64.3 v53.29,63.89 | v23.83,77.81 25.35,76.29 C19.1 | v20.27,82.38 20.47,82.38 24.23,86.14 IC4.7 24.33,86.24 24.94,86.24 27.69,88.99 27.69,90.1 28.8,91.22 29.41,91.22 IC4.12
  Bottom 0.203: v20.27,82.38 20.27,82.18 23.83,78.62 v23.83,77.81 26.26,75.37 34.19,75.37 34.39,75.58 42.21,75.58 46.69,71.1 46.69,70.9 53.29,64.3 v53.29,63.89
BANDPASS_OUT2  (via drill 0.4)
  Top 0.203: v49.73,56.47 49.73,55.05 R40.1 | v48.31,57.29 48.31,61.05 50.5,63.23 | 50.5,63.23 51.87,64.6 C18.- | v27.69,91.32 24.33,91.32 IC4.3 | v45.67,73.24 45.67,72.73 v44.75,71.82 | v50.44,63.28 50.5,63.23
  Bottom 0.203: v49.73,56.47 49.12,56.47 v48.31,57.29 | v27.69,91.32 37.85,91.32 47.19,81.98 47.19,74.46 45.97,73.24 v45.67,73.24 | v44.75,71.82 44.75,68.97 v50.44,63.28
FREQ_IN2
  Top 0.203: R41.1 37.13,57.49 32.87,57.49 R7.2 32.77,57.59 32.05,58.3 32.05,63.48 30.53,65.01 30.53,69.99 IC1.12
GND  (via drill 0.4)
  Top 0.406: 25.96,100.06 25.96,98.84 C32.1 25.86,98.54 25.86,98.03 16.81,88.99 16.81,88.28 IN3LEVEL.P$1 16.81,88.07 15.39,86.65 5.23,86.65 3.3,84.72 3.3,78.32 4.62,77 4.62,75.98 C4.1 4.72,75.88 4.72,70.8 C6.1 | 25.96,100.06 27.89,101.99 27.89,102.5 C1.2 27.89,102.7 27.89,106.16 C31.2 | 25.96,100.06 23.22,100.06 20.98,102.3 20.98,102.5 C2.1 20.98,102.7 20.98,109.92 IN3.GND | v26.87,81.57 27.89,80.55 27.89,80.05 C25.2 | IC3.1 64.47,82.79 64.47,85.43 61.93,87.97 IN1LEVEL.P$1 61.82,88.17 61.82,108.39 | 61.82,108.39 64.36,108.39 65.89,109.92 IN1.GND | 61.82,108.39 49.94,108.39 48.01,110.32 48.01,110.42 47.19,111.24 C11.2 46.99,111.14 46.79,111.14 v45.57,109.92 | 45.87,107.48 46.79,107.48 49.02,105.24 49.02,105.04 R4.2 | 45.87,107.48 43.43,109.92 IN2.GND | 44.86,87.56 39.88,87.56 39.47,87.97 IN2LEVEL.P$1 39.78,87.46 33.63,81.32 | 44.86,87.56 45.87,87.56 C26.1 | 33.63,81.32 34.09,80.86 34.09,80.05 C17.2 | 33.63,81.32 32.05,82.89 25.25,82.89 22.91,80.55 22.91,80.05 C5.2 22.81,79.84 19.96,77 18.03,77 16.21,75.17 16.21,71.1 14.99,69.89 | 44.86,87.56 44.86,94.78 45.77,95.69 45.77,107.38 45.87,107.48 | IC2.5 58.17,56.27 58.17,51.19 IC2.10 58.17,50.99 58.17,50.38 58.98,49.57 61.11,49.57 | 61.11,49.57 61.93,50.38 61.93,51.09 IC2.13 | V-OCT.P2 62.64,24.98 65.07,24.98 V-OCT.P1 | FREQUENCY.P$3 61.93,33.21 61.93,25.79 62.53,25.18 V-OCT.P2 | v62.13,45.81 62.13,47.84 61.21,48.75 61.21,49.46 61.11,49.57 | RESONANCE.P$3 31.95,33.31 32.46,33.82 35.92,33.82 D6.1 35.92,33.61 37.85,31.68 37.85,30.06 C29.2 37.85,29.86 35.2,27.21 35.2,25.08 RES.P1 | POWER.8 27.18,13.29 29.62,13.29 POWER.6
  Top 0.406: POWER.4 32.16,13.29 29.82,13.29 POWER.6 | POWER.7 27.18,18.88 29.62,18.88 POWER.5 | POWER.5 29.82,18.88 32.16,18.88 POWER.3 32.16,19.09 32.16,19.29 36.02,23.15 45.57,23.15 47.4,24.98 FM_IN.P2 | POWER.6 29.62,13.5 29.62,18.58 POWER.5 | C14.+ 46.99,14.72 49.23,16.95 53.49,16.95 54.31,17.77 C13.- 54.31,17.97 54.31,20.81 | FM_IN.P2 47.6,24.98 50.04,24.98 FM_IN.P1 50.24,24.88 54.31,20.81 | FM-LEVEL.P$3 46.99,33.21 46.99,25.69 47.5,25.18 FM_IN.P2 | V-OCT.P2 62.43,24.88 61.93,24.88 57.96,20.91 54.41,20.91 54.31,20.81 | C3.2 5.44,33.72 13.06,33.72 14.17,32.6 C27.2 14.38,32.6 19.56,32.6 C30.1 19.56,32.8 20.07,33.31 20.07,33.72 | 20.07,33.72 20.07,39.91 OUTPUT2.P1 | 20.07,33.72 22.5,33.72 22.71,33.51 22.71,31.48 20.17,28.94 20.17,25.08 OUTPUT1.P1 | R41.2 39.17,57.59 39.17,60.95 40.59,62.37 IC1.3 | C28.1 23.32,53.83 23.32,54.14 22.2,55.26 20.37,55.26 20.17,55.05 INPUT_MIX.P1 | 12.14,75.58 14.38,73.34 14.38,70.5 14.99,69.89 | 12.14,75.58 8.28,79.44 6.96,79.44 C9.2 | 14.99,69.89 16.81,68.06 OUTPUTLEVEL.P$1 | 12.14,75.58 20.37,83.81 20.37,85.53 23.52,88.68 24.23,88.68 IC4.5
  Bottom 0.406: IN3LEVEL.P$1 16.92,87.97 20.47,87.97 v26.87,81.57 26.77,81.87 31.55,86.65 38.05,86.65 39.37,87.97 IN2LEVEL.P$1 | v45.57,109.92 43.43,109.92 IN2.GND | v62.13,45.81 62.13,41.23 61.72,40.83 61.72,33.41 61.82,33.31 FREQUENCY.P$3 | RES.P1 35.2,25.08 38.15,25.08 39.98,26.91 45.67,26.91 47.5,25.08 FM_IN.P2 | LED1.1 9.5,15.33 9.5,17.16 LED1.4 9.7,17.26 12.34,17.26 20.07,24.98 OUTPUT1.P1 | OUTPUTLEVEL.P$1 16.92,67.95 16.92,59.73 20.07,56.58 20.07,55.05 INPUT_MIX.P1 20.17,54.85 21.59,53.43 | 21.59,53.43 31.24,53.43 40.18,62.37 40.59,62.37 IC1.3 | 21.59,53.43 21.49,53.33 21.49,52.41 20.17,51.09 20.17,40.02 OUTPUT2.P1 20.37,40.02 22.4,37.98 27.18,37.98 31.85,33.31 RESONANCE.P$3
N$1
  Top 0.203: R6.2 31.65,53.73 33.78,53.73 34.19,53.33 43.03,53.33 43.43,53.73 R9.1
N$2
  Top 0.203: R8.2 29.11,50.07 29.11,53.22 29.62,53.73 R6.1
N$3  (via drill 0.4)
  Top 0.203: v30.94,60.03 30.94,57.59 R7.1 | v26.37,68.56 v26.37,65.72 | v32.46,73.44 32.46,75.17 33.07,75.78 33.07,76.59 v33.78,77.3 | v34.9,78.42 34.9,78.83 36.83,80.76 36.83,81.27 41.91,86.34 46.69,86.34 46.89,86.55 46.89,89.8 | 46.89,89.8 46.89,92.75 45.97,93.66 R3.2 | v63.14,54.54 63.14,51.19 IC2.14 | v51.16,86.65 48.01,89.8 46.89,89.8
  Bottom 0.203: v30.94,60.03 28.91,62.06 28.91,63.48 26.67,65.72 v26.37,65.72 | v26.37,68.56 26.37,72.02 27.38,73.03 32.05,73.03 v32.46,73.44 | v34.9,78.42 v33.78,77.3 | v63.14,54.54 63.14,56.27 54,65.41 54,70.29 51.16,73.14 v51.16,86.65
N$5
  Top 0.203: R2.1 50.95,29.96 52.07,28.84 55.02,28.84 59.39,33.21 FREQUENCY.P$2
N$6
  Top 0.203: D1.A 2.59,28.74 4.42,28.74 14.27,18.88 24.54,18.88 POWER.9 24.64,18.78 24.64,13.29 POWER.10
N$8  (via drill 0.4)
  Top 0.203: v28.5,48.04 27.28,49.26 27.28,49.97 R8.1 | FM-LEVEL.P$1 39.98,31.38 39.98,25.08 FM_IN.P3
  Bottom 0.203: v28.5,48.04 41.81,34.73 41.81,33.31 FM-LEVEL.P$1
N$9  (via drill 0.4)
  Top 0.203: v41.3,43.67 46.38,48.75 46.38,54.24 49.63,57.49 49.63,58.71 R71.1
  Bottom 0.203: v41.3,43.67 41.3,41.44 48.21,34.53 48.21,32.29 43.33,27.42 35,27.42 32.66,25.08 RES.P2
N$10
  Top 0.203: IC5.6 39.57,49.46 39.57,50.58 IC5.7
N$11  (via drill 0.4)
  Top 0.203: v65.89,43.67 65.89,47.43 R57.1 | 39.57,47.23 39.57,48.04 IC5.5 | 39.57,47.23 v39.57,46.52 | v20.57,52.72 22.5,52.72 27.99,47.23 39.57,47.23
  Bottom 0.203: v65.89,43.67 65.89,34.94 62.94,31.99 54.1,31.99 v39.57,46.52 | v20.57,52.72 18.85,54.44 18.85,55.46 14.48,59.83 14.48,67.95 OUTPUTLEVEL.P$2
N$12  (via drill 0.4)
  Top 0.203: R2.2 52.88,30.06 52.88,34.94 R59.2 52.88,35.04 51.66,36.26 51.66,42.45 | 51.66,42.45 51.66,45.2 | 51.66,45.2 51.66,47.43 R61.2 51.77,47.43 52.68,48.35 v52.98,48.35 | v43.94,47.43 45.26,48.75 45.26,53.73 R9.2 | v47.8,47.43 50.04,45.2 51.66,45.2 | 51.66,42.45 66.4,42.45 68.83,44.89 68.83,53.43 65.79,56.47 65.79,59.93 R60.3 | v60.3,52.92 60.6,52.61 60.6,51.19 IC2.12
  Bottom 0.203: v47.8,47.43 v43.94,47.43 | v60.3,52.92 57.56,52.92 v52.98,48.35
N$13  (via drill 0.4)
  Top 0.203: v59.89,61.05 57.76,63.18 R32.1 | v63.96,49.46 v63.96,53.33 | v61.11,45.2 59.99,45.2 58.47,46.72 58.47,47.43 R29.2 58.37,47.53 56.95,48.96 56.95,51.09 IC2.9
  Bottom 0.203: v59.89,61.05 60.81,61.05 63.96,57.9 v63.96,53.33 | v63.96,49.46 63.96,48.75 61.11,45.91 v61.11,45.2
N$15
  Top 0.203: 55.98,49.62 56.24,49.87 56.24,55.66 56.85,56.27 IC2.6 | 55.98,49.62 55.93,49.57 51.36,49.57 49.73,51.19 R31.1 | R28.2 65.89,52.41 65.89,49.97 62.94,47.03 62.94,45.5 61.82,44.38 59.59,44.38 56.03,47.94 56.03,49.57 55.98,49.62
N$18
  Top 0.203: C17.1 32.05,79.94 31.45,79.94 27.79,76.29 27.79,72.22 27.99,72.02 27.99,70.09 IC1.11
N$20  (via drill 0.4)
  Top 0.203: v25.96,112.56 25.96,110.02 R5.1
  Bottom 0.203: v25.96,112.56 35.2,112.56 36.63,113.98 46.79,113.98 53.19,107.58 53.19,71.71 56.85,68.06 IN_GAIN.P$3
N$21  (via drill 0.4)
  Top 0.203: v41,55.87 42.62,57.49 43.43,57.49 R39.1 | v35.1,58.91 v38.15,58.91
  Bottom 0.203: v41,55.87 41,56.07 v38.15,58.91 | v35.1,58.91 34.29,59.73 31.75,59.73 31.24,59.22 28.6,59.22 25.45,62.37 IC1.9
N$28  (via drill 0.4)
  Top 0.203: v49.33,52.72 51.56,54.95 R40.2 | v34.19,55.05 33.68,55.05 32.36,56.37 30.12,56.37 29.92,56.58 29.92,60.13 30.63,60.84 30.84,60.84 31.45,61.45 31.45,63.48 30.94,63.99 29.51,63.99 27.99,62.47 IC1.8
  Bottom 0.203: v49.33,52.72 44.35,52.72 43.03,51.39 37.85,51.39 v34.19,55.05
N$29
  Top 0.203: R42.2 31.65,76.19 31.65,71.51 33.07,70.09 IC1.13
N$30  (via drill 0.4)
  Top 0.203: v4.93,81.67 4.93,79.54 C9.1 | v48.72,71.1 46.08,68.46 42.21,68.46 40.69,69.99 IC1.16
  Bottom 0.203: v4.93,81.67 4.93,107.17 9.5,111.75 35,111.75 36.12,112.86 44.65,112.86 48.72,108.8 v48.72,71.1
N$31
  Top 0.203: R14.1 52.27,83.81 53.39,84.92 54.81,84.92 55.12,84.62 55.12,77.71 51.97,74.56 51.97,67.85 C18.+ 51.87,67.75 50.85,66.74 50.85,65.62 46.08,60.84 44.86,60.84 37.74,53.73 34.39,53.73 32.46,55.66 23.32,55.66 17.42,61.55 17.42,65.92 21.49,69.99 25.35,69.99 IC1.10
N$32
  Top 0.203: C19.2 23.42,76.19 23.42,74.05 26.97,70.5 26.97,69.07 27.58,68.46 28.3,68.46 29.51,69.68 29.51,71 30.12,71.61 30.94,71.61 32.05,70.5 32.05,65.92 35.51,62.47 IC1.5
N$33
  Top 0.203: 23.37,59.98 18.44,64.91 C16.2 | 23.37,59.98 23.42,59.93 23.42,57.59 R16.1 | IC1.7 30.43,62.37 29.82,62.37 27.48,60.03 23.42,60.03 23.37,59.98
N$34  (via drill 0.4)
  Top 0.203: v29.72,64.91 20.47,64.91 C16.1
  Bottom 0.203: v29.72,64.91 35.61,64.91 38.05,62.47 IC1.4
N$35
  Top 0.203: R38.1 13.06,47.94 13.06,51.19 16.31,54.44 16.31,65.62 22.4,71.71 22.4,77.61 24.94,80.15 24.94,81.77 25.55,82.38 31.75,82.38 33.17,80.96 33.17,79.03 34.9,77.3 34.9,72.73 37.13,70.5 37.13,68.46 43.13,62.47 IC1.2
N$36  (via drill 0.4)
  Top 0.203: v18.85,59.01 18.85,56.27 | 18.85,56.27 18.85,51.8 13.87,46.82 12.24,46.82 12.04,47.03 12.04,47.13 11.23,47.94 R38.2 | v43.94,72.63 45.36,74.05 45.67,74.05 47.8,76.19 R37.2 | v28.3,52.51 28.3,52.82 25.86,55.26 23.11,55.26 22.1,56.27 18.85,56.27
  Bottom 0.203: v18.85,59.01 18.85,70.5 20.47,72.12 21.39,72.12 29.51,63.99 31.45,63.99 32.97,62.47 IC1.6 | v43.94,72.63 43.94,71.31 44.35,70.9 44.35,68.26 53.59,59.01 58.57,59.01 59.08,58.51 59.08,57.9 57.25,56.07 53.8,56.07 47.8,50.07 32.36,50.07 29.92,52.51 v28.3,52.51
N$37  (via drill 0.4)
  Top 0.203: v25.35,59.01 25.35,57.59 R16.2 | v20.78,71.31 20.78,73.85 v21.59,74.66
  Bottom 0.203: v25.35,59.01 25.35,60.54 20.78,65.11 v20.78,71.31 | v21.59,74.66 28.6,74.66 28.91,74.97 36.83,74.97 37.03,75.17 37.64,75.17 42.21,70.6 42.21,65.92 45.67,62.47 IC1.1
N$38
  Top 0.203: R36.2 47.8,79.94 45.97,78.12 45.97,76.29 R37.1 45.87,76.19 45.87,75.78 41.66,71.56 | 41.66,71.56 43.13,70.09 IC1.17 | 41.66,71.56 41.61,71.61 38.96,71.61 36.02,74.56 36.02,76.19 R30.1
N$41  (via drill 0.4)
  Top 0.203: 39.52,78.88 39.57,78.83 44.75,78.83 45.87,79.94 R36.1 | 39.52,78.88 38.46,79.94 R15.1 | v38.15,73.54 38.15,74.36 39.47,75.68 39.47,78.83 39.52,78.88
  Bottom 0.203: v38.15,73.54 38.15,70.09 IC1.15
N$42
  Top 0.203: R15.2 40.39,80.05 42.21,80.05 45.87,83.7 R33.1 45.97,83.7 47.09,82.59 48.82,82.59 | 48.82,82.59 52.98,82.59 53.19,82.79 53.19,82.89 54,83.7 R14.2 | 48.82,82.59 48.82,75.27 45.77,72.22 45.77,70.09 IC1.18
N$63
  Top 0.203: IC4.1 24.33,93.76 24.33,92.54 IC4.2 24.23,92.44 23.62,92.44 18.64,87.46 18.64,87.36 15.9,84.62 4.01,84.62 3.81,84.41 3.81,78.62 5.44,77 5.54,77 5.74,76.79 5.74,74.25 6.86,73.14 7.06,73.14 11.84,68.36 11.84,68.06 OUTPUTLEVEL.P$3
N$67
  Top 0.203: R59.1 50.85,34.94 50.85,31.79 49.94,30.87 49.94,29.04 53.9,25.08 54.91,25.08 V-OCT.P3
N$68
  Top 0.203: R3.1 47.9,93.66 47.9,92.44 61.93,78.42 61.93,69.78 63.25,68.46 63.25,60.03 R60.2 63.14,60.03 60.71,60.03 R60.1
N$74  (via drill 0.4)
  Top 0.203: v55.22,88.28 47.29,96.2 47.29,104.94 R4.1
  Bottom 0.203: v55.22,88.28 55.22,77.4 68.33,64.3 68.33,14.31 68.12,14.11 62.94,14.11 61.82,15.22 LED2.2 61.82,15.33 61.82,17.16 LED2.3
N$75  (via drill 0.4)
  Top 0.203: v4.11,50.68 5.33,49.46 5.33,49.26 R1.1
  Bottom 0.203: v4.11,50.68 4.11,17.36 4.22,17.26 LED1.3 4.32,17.16 4.32,15.33 LED1.2
N$76
  Bottom 0.203: IN1.TIP 54.41,109.92 54.41,98.23 56.85,95.79 56.85,88.07 IN1LEVEL.P$3
N$77
  Top 0.203: IN2.TIP 31.95,109.92 31.95,106.16 35.41,102.7 35.41,88.99 34.49,88.07 IN2LEVEL.P$3
N$78
  Top 0.203: D3.A 22,43.88 22,35.04 23.42,33.61 23.42,26.6 24.94,25.08 RES.P3
N$79
  Top 0.203: R55.2 27.89,115 40.08,115 44.75,110.32 44.75,109.61 46.38,107.99 48.01,107.99 59.39,96.61 59.39,88.07 IN1LEVEL.P$2
N$80
  Top 0.203: R56.2 5.44,115 19.05,115 26.06,107.99 29.51,107.99 35,102.5 35,90.41 33.07,88.48 33.07,87.56 33.88,86.75 35.61,86.75 36.83,87.97 IN2LEVEL.P$2
N$82
  Bottom 0.203: IN3.TIP 9.5,109.92 9.5,98.13 11.84,95.79 11.84,88.07 IN3LEVEL.P$3
N$83
  Top 0.203: R62.2 5.44,101.28 5.44,96.91 14.38,87.97 IN3LEVEL.P$2
N$84  (via drill 0.4)
  Top 0.203: R62.1 3.51,101.28 3.51,115 R56.1 3.51,115.1 4.52,116.11 24.84,116.11 25.86,115.1 R55.1 25.96,113.67 27.79,111.85 27.79,110.02 R5.2 27.89,109.92 28.91,108.9 v29.11,108.9 | v26.87,89.39 24.94,87.46 24.33,87.46 IC4.6
  Bottom 0.203: v26.87,89.39 26.87,106.67 v29.11,108.9
N$85
  Top 0.203: R72.2 37.85,45.09 36.12,46.82 23.72,46.82 22,48.55 D3.C
N$89  (via drill 0.4)
  Top 0.203: D6.3 36.83,36.15 36.83,44.18 36.02,44.99 R72.1 35.92,45.09 35.1,45.91 21.59,45.91 19.76,47.74 19.76,53.02 20.27,53.53 20.37,53.53 21.18,54.34 v21.89,54.34 | v35.41,84.62 31.34,88.68 29.51,88.68 IC4.10 | v33.88,76.19 33.88,71.21 34.59,70.5 34.59,65.41 36.53,63.48 36.53,61.45 v33.99,58.91
  Bottom 0.203: v35.41,84.62 41.3,84.62 41.91,84.01 41.91,78.93 39.17,76.19 v33.88,76.19 | v33.99,58.91 31.55,58.91 26.97,54.34 v21.89,54.34
N$102  (via drill 0.4)
  Top 0.203: v13.46,83.5 R79.2 | v15.8,85.84 16.51,85.84 18.24,87.56 18.24,89.6 23.11,94.47 28.8,94.47 29.41,93.86 IC4.14 29.51,93.76 29.51,92.54 IC4.13
  Bottom 0.203: v15.8,85.84 v13.46,83.5
N$103  (via drill 0.4)
  Top 0.203: v9.4,71.92 8.18,73.14 8.18,76.39 7.57,77 7.47,77 5.94,78.52 5.94,81.77 4.83,82.89 4.83,83.5 R79.1
  Bottom 0.203: v9.4,71.92 9.4,69.58 9.19,69.38 9.19,55.76 9.91,55.05 INPUT_MIX.P3
O1
  Top 0.203: R10.2 6.65,63.69 6.65,43.27 9.91,40.02 OUTPUT2.P3
O2
  Top 0.203: R57.2 67.82,47.53 66.7,48.65 65.18,48.65 63.35,46.82 63.35,45.3 62.03,43.98 58.47,43.98 53.29,49.16 48.41,49.16 42.01,42.76 42.01,35.75 38.86,32.6 38.86,27.01 35.1,23.25 11.73,23.25 10.01,24.98 OUTPUT1.P3
RESONANCE_CTL2  (via drill 0.4)
  Top 0.203: v45.26,55.26 45.26,57.49 R39.2 | v42.72,52.21 43.64,52.21 44.25,51.6 44.25,49.26 37.74,42.76 37.74,35.24 37.44,34.94 31.04,34.94 29.41,33.31 RESONANCE.P$2
  Bottom 0.203: v45.26,55.26 45.26,54.75 v42.72,52.21
RESONANCE_IN2  (via drill 0.4)
  Top 0.203: IC4.9 29.51,87.36 29.51,86.24 IC4.8 29.41,86.14 26.16,86.14 22.3,82.28 21.29,82.28 15.29,76.29 v15.29,71.51
  Bottom 0.203: v15.29,71.51 13.77,71.51 11.53,69.28 11.33,69.28 10.62,68.56 10.62,56.07 18.85,47.84 18.85,39.51 25.04,33.31 26.87,33.31 RESONANCE.P$1

### Text on the board
Bottom: The Queen in Red | Inputs | Outputs | Res | Frequency
tNames: -12V
bNames: Based on work by / Forestcaver | V1.0 / (CC BY 4.0) | Band pass filter / Design Andy C
bStop: The Queen in Red | Inputs | Outputs | Res | Frequency